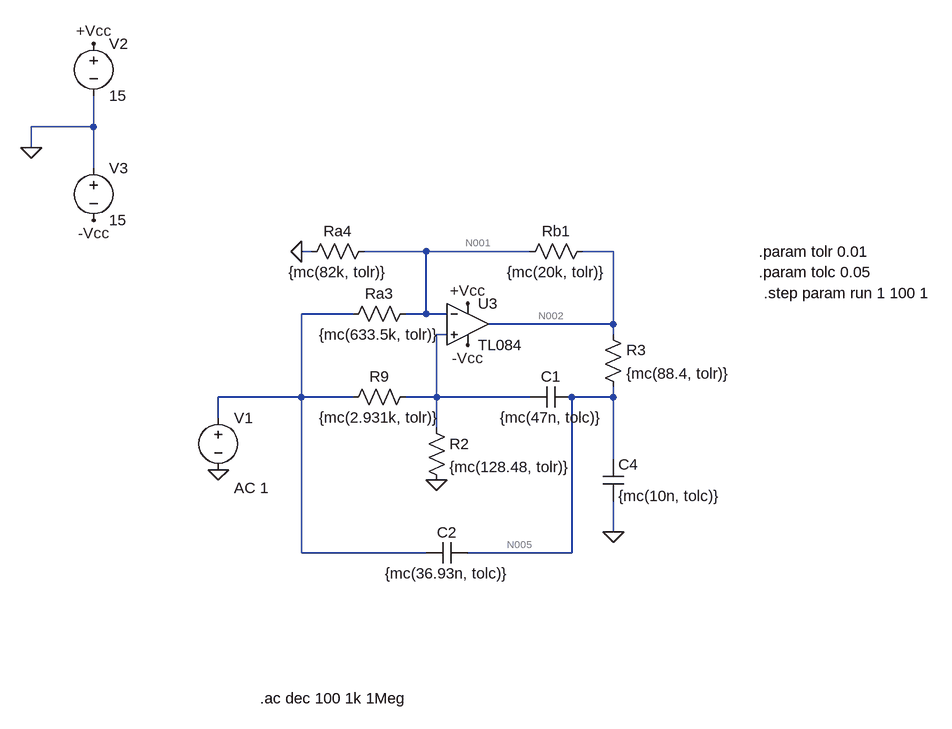
[diagram p0: schematic Sedra_MC_etapa1.asc]
Sedra_MC_etapa1.asc, the LTspice schematic file:
Version 4
SHEET 1 1996 680
WIRE -192 -480 -192 -528
WIRE -192 -480 -288 -480
WIRE -288 -448 -288 -480
WIRE -192 -416 -192 -480
WIRE 144 -288 128 -288
WIRE 320 -288 224 -288
WIRE 480 -288 320 -288
WIRE 608 -288 560 -288
WIRE 208 -192 128 -192
WIRE 320 -192 320 -288
WIRE 320 -192 288 -192
WIRE 352 -192 320 -192
WIRE 608 -176 608 -288
WIRE 608 -176 416 -176
WIRE 352 -160 336 -160
WIRE 608 -160 608 -176
WIRE 128 -64 128 -192
WIRE 128 -64 0 -64
WIRE 208 -64 128 -64
WIRE 336 -64 336 -160
WIRE 336 -64 288 -64
WIRE 480 -64 336 -64
WIRE 608 -64 608 -80
WIRE 608 -64 544 -64
WIRE 0 -32 0 -64
WIRE 336 -16 336 -64
WIRE 608 32 608 -64
WIRE 608 144 608 96
WIRE 128 176 128 -64
WIRE 320 176 128 176
WIRE 544 176 544 -64
WIRE 544 176 384 176
FLAG 0 48 0
FLAG -288 -448 0
FLAG -192 -608 +Vcc
FLAG -192 -336 -Vcc
FLAG 336 64 0
FLAG 128 -288 0
FLAG 608 144 0
FLAG 384 -208 +Vcc
FLAG 384 -144 -Vcc
SYMBOL voltage 0 -48 R0
WINDOW 123 24 124 Left 2
WINDOW 39 0 0 Left 0
SYMATTR Value2 AC 1
SYMATTR InstName V1
SYMATTR Value ""
SYMBOL voltage -192 -624 R0
WINDOW 123 0 0 Left 0
WINDOW 39 0 0 Left 0
SYMATTR InstName V2
SYMATTR Value 15
SYMBOL voltage -192 -432 R0
WINDOW 123 0 0 Left 0
WINDOW 39 0 0 Left 0
SYMATTR InstName V3
SYMATTR Value 15
SYMBOL res 304 -80 R90
WINDOW 0 0 56 VBottom 2
WINDOW 3 32 56 VTop 2
SYMATTR InstName R9
SYMATTR Value {mc(2.931k, tolr)}
SYMBOL res 304 -208 R90
WINDOW 0 0 56 VBottom 2
WINDOW 3 32 56 VTop 2
SYMATTR InstName Ra3
SYMATTR Value {mc(633.5k, tolr)}
SYMBOL res 320 -32 R0
SYMATTR InstName R2
SYMATTR Value {mc(128.48, tolr)}
SYMBOL cap 544 -80 R90
WINDOW 0 0 32 VBottom 2
WINDOW 3 32 32 VTop 2
SYMATTR InstName C1
SYMATTR Value {mc(47n, tolc)}
SYMBOL cap 384 160 R90
WINDOW 0 0 32 VBottom 2
WINDOW 3 32 32 VTop 2
SYMATTR InstName C2
SYMATTR Value {mc(36.93n, tolc)}
SYMBOL res 240 -304 R90
WINDOW 0 0 56 VBottom 2
WINDOW 3 32 56 VTop 2
SYMATTR InstName Ra4
SYMATTR Value {mc(82k, tolr)}
SYMBOL res 576 -304 R90
WINDOW 0 0 56 VBottom 2
WINDOW 3 32 56 VTop 2
SYMATTR InstName Rb1
SYMATTR Value {mc(20k, tolr)}
SYMBOL cap 592 32 R0
SYMATTR InstName C4
SYMATTR Value {mc(10n, tolc)}
SYMBOL res 592 -176 R0
SYMATTR InstName R3
SYMATTR Value {mc(88.4, tolr)}
SYMBOL sympropio\\TL084 384 -240 R0
SYMATTR InstName U3
TEXT 64 400 Left 2 !.ac dec 100 1k 1Meg
TEXT 832 -288 Left 2 !.param tolr 0.01
TEXT 832 -256 Left 2 !.param tolc 0.05
TEXT 840 -224 Left 2 !.step param run 1 100 1

The netlist it stands for:
* Sedra_MC_etapa1.asc
V1 N003 0 AC 1
V2 +Vcc 0 15
V3 0 -Vcc 15
R9 N004 N003 {mc(2.931k, tolr)}
Ra3 N001 N003 {mc(633.5k, tolr)}
R2 N004 0 {mc(128.48, tolr)}
C1 N005 N004 {mc(47n, tolc)}
C2 N005 N003 {mc(36.93n, tolc)}
Ra4 N001 0 {mc(82k, tolr)}
Rb1 N002 N001 {mc(20k, tolr)}
C4 N005 0 {mc(10n, tolc)}
R3 N002 N005 {mc(88.4, tolr)}
* U3: TL084 (symbol sympropio\TL084 not available, pins judged from their places): In+=N004 In-=N001 V+=+Vcc V-=-Vcc OUT=N002
.ac dec 100 1k 1Meg
.param tolr 0.01
.param tolc 0.05
.step param run 1 100 1
.backanno
.end

* Results of the author's LTspice run, read from the files saved beside the schematic
* Operating Point (first step), zero values left out:
*   run = 1 
*   V(+vcc) = 15 V
*   V(-vcc) = -15 V
*   V(n001) = 10.97 µV
*   V(n005) = 14.88 µV
*   V(n002) = 14.88 µV
*   I(Rb1) = 196.1 pA
*   I(Ra4) = 133.8 pA
*   I(R2) = -43.15 pA
*   I(Ra3) = 17.29 pA
*   I(R9) = -1.899 pA
*   I(V3) = -14.19 mA
*   I(V2) = -14.19 mA
*   I(V1) = 15.39 pA
*   Ix(u3:1) = 45.05 pA
*   Ix(u3:2) = 45.05 pA
*   Ix(u3:3) = 14.19 mA
*   Ix(u3:4) = -14.19 mA
*   Ix(u3:5) = -196.1 pA